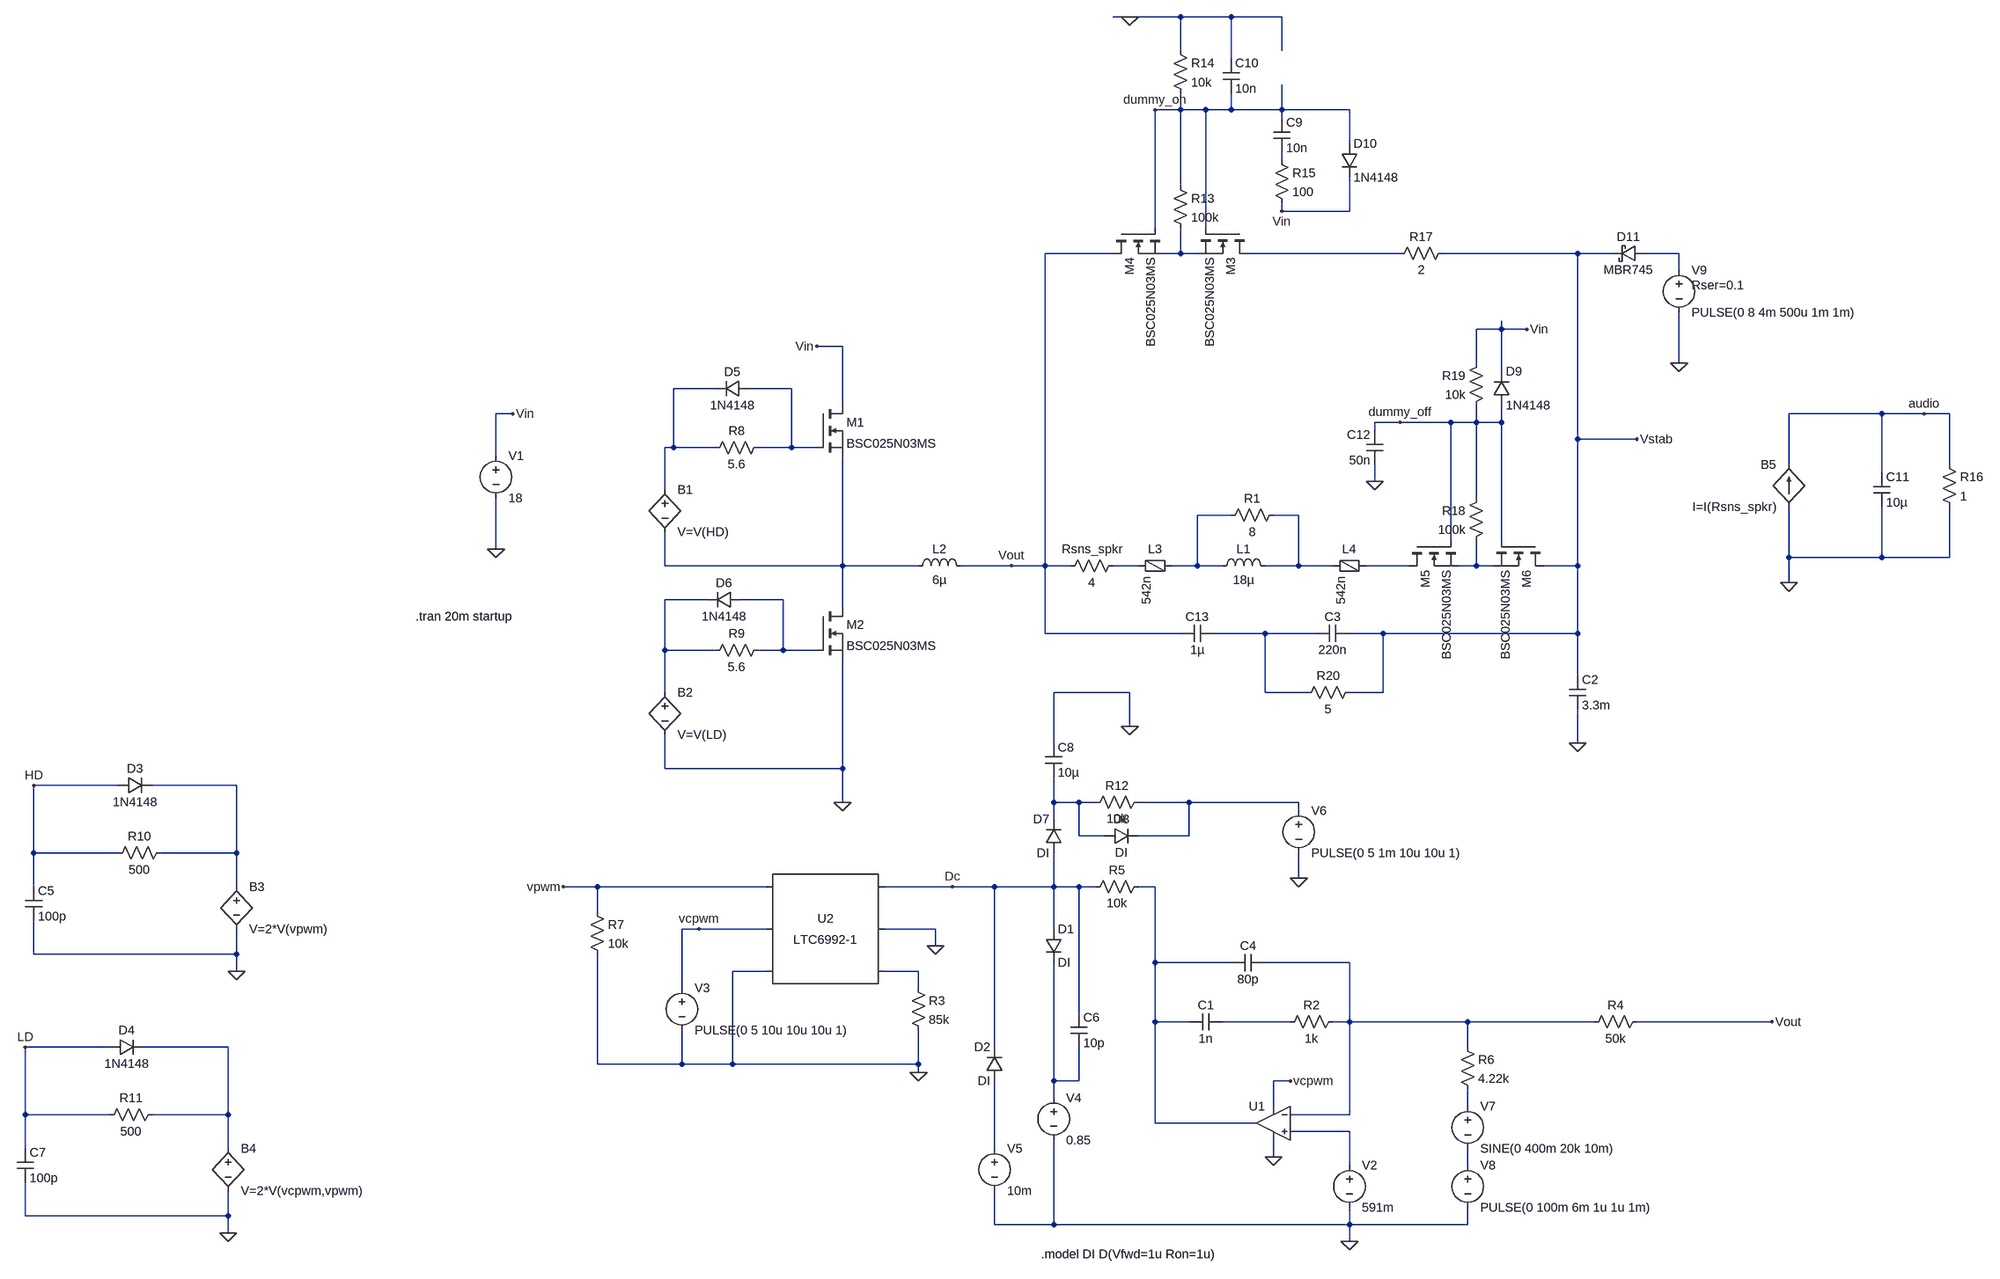
[diagram p0: schematic TPS40195_Power_Amp_Switching_Model.asc]
TPS40195_Power_Amp_Switching_Model.asc, the LTspice schematic file:
Version 4
SHEET 1 2888 1352
WIRE 848 -1008 816 -1008
WIRE 944 -1008 848 -1008
WIRE 1040 -1008 944 -1008
WIRE 1136 -1008 1040 -1008
WIRE 944 -944 944 -1008
WIRE 1136 -944 1136 -1008
WIRE 1040 -928 1040 -1008
WIRE 944 -832 944 -864
WIRE 944 -832 896 -832
WIRE 992 -832 944 -832
WIRE 1040 -832 1040 -864
WIRE 1040 -832 992 -832
WIRE 1136 -832 1136 -880
WIRE 1136 -832 1040 -832
WIRE 1264 -832 1136 -832
WIRE 1136 -816 1136 -832
WIRE 1264 -768 1264 -832
WIRE 1136 -736 1136 -752
WIRE 944 -688 944 -832
WIRE 1136 -640 1136 -656
WIRE 1264 -640 1264 -704
WIRE 1264 -640 1136 -640
WIRE 896 -608 896 -832
WIRE 992 -608 992 -832
WIRE 816 -560 688 -560
WIRE 944 -560 944 -608
WIRE 944 -560 912 -560
WIRE 976 -560 944 -560
WIRE 1360 -560 1072 -560
WIRE 1696 -560 1440 -560
WIRE 1760 -560 1696 -560
WIRE 1888 -560 1824 -560
WIRE 1888 -528 1888 -560
WIRE 1552 -416 1552 -432
WIRE 1552 -416 1504 -416
WIRE 1600 -416 1552 -416
WIRE 304 -384 256 -384
WIRE 1504 -352 1504 -416
WIRE 1888 -352 1888 -448
WIRE 1552 -336 1552 -416
WIRE 64 -304 -16 -304
WIRE 208 -304 128 -304
WIRE 304 -272 304 -384
WIRE -320 -256 -352 -256
WIRE 2272 -256 2096 -256
WIRE 2352 -256 2272 -256
WIRE 2400 -256 2352 -256
WIRE 1360 -240 1312 -240
WIRE 1456 -240 1360 -240
WIRE 1504 -240 1504 -272
WIRE 1504 -240 1456 -240
WIRE 1552 -240 1552 -272
WIRE 1552 -240 1504 -240
WIRE 1312 -224 1312 -240
WIRE 1696 -208 1696 -560
WIRE 1808 -208 1696 -208
WIRE -16 -192 -16 -304
WIRE -16 -192 -32 -192
WIRE 64 -192 -16 -192
WIRE 208 -192 208 -304
WIRE 208 -192 144 -192
WIRE 256 -192 208 -192
WIRE -352 -176 -352 -256
WIRE 2096 -160 2096 -256
WIRE 2400 -160 2400 -256
WIRE 2272 -144 2272 -256
WIRE 1312 -128 1312 -160
WIRE -32 -112 -32 -192
WIRE 1504 -96 1504 -240
WIRE 1040 -64 976 -64
WIRE 1168 -64 1120 -64
WIRE 1456 -16 1456 -240
WIRE 1552 -16 1552 -240
WIRE -352 0 -352 -96
WIRE 2096 16 2096 -80
WIRE 2272 16 2272 -80
WIRE 2272 16 2096 16
WIRE 2400 16 2400 -80
WIRE 2400 16 2272 16
WIRE -32 32 -32 -32
WIRE 304 32 304 -176
WIRE 304 32 -32 32
WIRE 448 32 304 32
WIRE 624 32 528 32
WIRE 688 32 688 -560
WIRE 688 32 624 32
WIRE 736 32 688 32
WIRE 864 32 816 32
WIRE 976 32 976 -64
WIRE 976 32 928 32
WIRE 1024 32 976 32
WIRE 1168 32 1168 -64
WIRE 1168 32 1104 32
WIRE 1232 32 1168 32
WIRE 1376 32 1296 32
WIRE 1504 32 1504 -16
WIRE 1504 32 1472 32
WIRE 1536 32 1504 32
WIRE 1696 32 1696 -208
WIRE 1696 32 1632 32
WIRE 2096 64 2096 16
WIRE 48 96 -32 96
WIRE 192 96 112 96
WIRE 304 112 304 32
WIRE 688 160 688 32
WIRE 944 160 688 160
WIRE 1104 160 1008 160
WIRE 1200 160 1104 160
WIRE 1328 160 1264 160
WIRE 1696 160 1696 32
WIRE 1696 160 1328 160
WIRE -32 192 -32 96
WIRE 64 192 -32 192
WIRE 192 192 192 96
WIRE 192 192 144 192
WIRE 256 192 192 192
WIRE 1696 240 1696 160
WIRE -32 272 -32 192
WIRE 848 272 704 272
WIRE 1104 272 1104 160
WIRE 1184 272 1104 272
WIRE 1328 272 1328 160
WIRE 1328 272 1264 272
WIRE 848 336 848 272
WIRE 704 368 704 272
WIRE 1696 368 1696 304
WIRE -32 416 -32 352
WIRE 304 416 304 208
WIRE 304 416 -32 416
WIRE -1152 448 -1312 448
WIRE -928 448 -1088 448
WIRE 304 480 304 416
WIRE 704 480 704 432
WIRE 752 480 704 480
WIRE 784 480 752 480
WIRE 960 480 864 480
WIRE 1168 480 960 480
WIRE 1168 496 1168 480
WIRE 704 512 704 480
WIRE 752 544 752 480
WIRE 800 544 752 544
WIRE 960 544 960 480
WIRE 960 544 864 544
WIRE -1312 576 -1312 448
WIRE -1152 576 -1312 576
WIRE -928 576 -928 448
WIRE -928 576 -1072 576
WIRE 1168 624 1168 576
WIRE -1312 640 -1312 576
WIRE -928 640 -928 576
WIRE -160 640 -224 640
WIRE 160 640 -160 640
WIRE 512 640 384 640
WIRE 592 640 512 640
WIRE 704 640 704 576
WIRE 704 640 592 640
WIRE 752 640 704 640
WIRE 784 640 752 640
WIRE 896 640 864 640
WIRE -160 688 -160 640
WIRE 32 720 0 720
WIRE 160 720 32 720
WIRE 480 720 384 720
WIRE 704 720 704 640
WIRE 480 752 480 720
WIRE -1312 768 -1312 704
WIRE -928 768 -928 720
WIRE -928 768 -1312 768
WIRE 896 784 896 640
WIRE 1040 784 896 784
WIRE 1264 784 1104 784
WIRE -928 800 -928 768
WIRE 160 800 96 800
WIRE 448 800 384 800
WIRE 0 832 0 720
WIRE 448 832 448 800
WIRE 752 880 752 640
WIRE 896 896 896 784
WIRE 960 896 896 896
WIRE 1152 896 1024 896
WIRE 1264 896 1264 784
WIRE 1264 896 1232 896
WIRE 1488 896 1264 896
WIRE 1728 896 1488 896
WIRE 2064 896 1808 896
WIRE -1168 944 -1328 944
WIRE -944 944 -1104 944
WIRE 592 944 592 640
WIRE 1488 944 1488 896
WIRE -160 976 -160 768
WIRE 0 976 0 912
WIRE 0 976 -160 976
WIRE 96 976 96 800
WIRE 96 976 0 976
WIRE 448 976 448 912
WIRE 448 976 96 976
WIRE 448 992 448 976
WIRE 704 1008 704 784
WIRE 752 1008 752 944
WIRE 752 1008 704 1008
WIRE 1152 1008 1120 1008
WIRE 704 1040 704 1008
WIRE 1120 1056 1120 1008
WIRE 1488 1056 1488 1024
WIRE -1328 1072 -1328 944
WIRE -1168 1072 -1328 1072
WIRE -944 1072 -944 944
WIRE -944 1072 -1088 1072
WIRE 1264 1072 1264 896
WIRE 1264 1072 1152 1072
WIRE 896 1088 896 896
WIRE 1088 1088 896 1088
WIRE 1264 1104 1152 1104
WIRE -1328 1136 -1328 1072
WIRE -944 1136 -944 1072
WIRE 592 1136 592 1008
WIRE 1120 1152 1120 1120
WIRE 1264 1168 1264 1104
WIRE 1488 1168 1488 1136
WIRE -1328 1264 -1328 1200
WIRE -944 1264 -944 1216
WIRE -944 1264 -1328 1264
WIRE 592 1280 592 1216
WIRE 704 1280 704 1120
WIRE 704 1280 592 1280
WIRE 1264 1280 1264 1248
WIRE 1264 1280 704 1280
WIRE 1488 1280 1488 1248
WIRE 1488 1280 1264 1280
WIRE -944 1296 -944 1264
WIRE 1264 1312 1264 1280
FLAG 1696 368 0
FLAG -352 0 0
FLAG 624 32 Vout
FLAG -320 -256 Vin
FLAG 512 640 Dc
FLAG 1120 1152 0
FLAG 1264 1312 0
FLAG 2064 896 Vout
FLAG 1808 -208 Vstab
FLAG 304 480 0
FLAG 256 -384 Vin
FLAG 480 752 0
FLAG 448 992 0
FLAG -224 640 vpwm
FLAG -928 800 0
FLAG -1312 448 HD
FLAG -944 1296 0
FLAG -1328 944 LD
FLAG 32 720 vcpwm
FLAG 848 336 0
FLAG 1168 624 0
FLAG 1136 -640 Vin
FLAG 848 -1008 0
FLAG 2096 64 0
FLAG 2352 -256 audio
FLAG 1152 1008 vcpwm
FLAG 1600 -416 Vin
FLAG 1312 -128 0
FLAG 896 -832 dummy_on
FLAG 1360 -240 dummy_off
FLAG 1888 -352 0
DATAFLAG 624 640 ""
DATAFLAG 928 784 ""
SYMBOL voltage -352 -192 R0
WINDOW 123 0 0 Left 0
WINDOW 39 0 0 Left 0
SYMATTR InstName V1
SYMATTR Value 18
SYMBOL ind 1008 48 R270
WINDOW 0 32 56 VTop 2
WINDOW 3 5 56 VBottom 2
SYMATTR InstName L1
SYMATTR Value 18µ
SYMATTR SpiceLine Rser=1u
SYMBOL cap 1680 240 R0
SYMATTR InstName C2
SYMATTR Value 3.3m
SYMATTR SpiceLine Rser=20m
SYMBOL cap 1264 144 R90
WINDOW 0 0 32 VBottom 2
WINDOW 3 32 32 VTop 2
SYMATTR InstName C3
SYMATTR Value 220n
SYMBOL res 1024 -48 R270
WINDOW 0 32 56 VTop 2
WINDOW 3 0 56 VBottom 2
SYMATTR InstName R1
SYMATTR Value 8
SYMBOL Opamps\\UniversalOpamp2 1120 1088 M0
SYMATTR InstName U1
SYMATTR Value2 Avol=1k GBW=7Meg Slew=10Meg
SYMATTR SpiceLine ilimit=25m rail=0 Vos=0 phimargin=68
SYMBOL voltage 1264 1152 R0
WINDOW 123 0 0 Left 0
WINDOW 39 0 0 Left 0
SYMATTR InstName V2
SYMATTR Value 591m
SYMBOL cap 1024 880 R90
WINDOW 0 0 32 VBottom 2
WINDOW 3 32 32 VTop 2
SYMATTR InstName C1
SYMATTR Value 1n
SYMBOL res 1248 880 R90
WINDOW 0 0 56 VBottom 2
WINDOW 3 32 56 VTop 2
SYMATTR InstName R2
SYMATTR Value 1k
SYMBOL cap 1104 768 R90
WINDOW 0 0 32 VBottom 2
WINDOW 3 32 32 VTop 2
SYMATTR InstName C4
SYMATTR Value 80p
SYMBOL res 1824 880 R90
WINDOW 0 0 56 VBottom 2
WINDOW 3 32 56 VTop 2
SYMATTR InstName R4
SYMATTR Value 50k
SYMBOL res 880 624 R90
WINDOW 0 0 56 VBottom 2
WINDOW 3 32 56 VTop 2
SYMATTR InstName R5
SYMATTR Value 10k
SYMBOL res 1472 928 R0
SYMATTR InstName R6
SYMATTR Value 4.22k
SYMBOL diode 688 720 R0
SYMATTR InstName D1
SYMATTR Value DI
SYMBOL voltage 704 1024 R0
WINDOW 123 0 0 Left 0
WINDOW 39 0 0 Left 0
SYMATTR InstName V4
SYMATTR Value 0.85
SYMBOL diode 608 1008 R180
WINDOW 0 24 64 Left 2
WINDOW 3 24 0 Left 2
SYMATTR InstName D2
SYMATTR Value DI
SYMBOL voltage 592 1120 R0
WINDOW 123 0 0 Left 0
WINDOW 39 0 0 Left 0
SYMATTR InstName V5
SYMATTR Value 10m
SYMBOL voltage 1488 1040 R0
WINDOW 123 0 0 Left 0
WINDOW 39 0 0 Left 0
SYMATTR InstName V7
SYMATTR Value SINE(0 400m 20k 10m)
SYMBOL cap 736 880 R0
SYMATTR InstName C6
SYMATTR Value 10p
SYMBOL nmos 256 -272 R0
SYMATTR InstName M1
SYMATTR Value BSC025N03MS
SYMBOL nmos 256 112 R0
SYMATTR InstName M2
SYMATTR Value BSC025N03MS
SYMBOL ind 432 48 R270
WINDOW 0 32 56 VTop 2
WINDOW 3 5 56 VBottom 2
SYMATTR InstName L2
SYMATTR Value 6µ
SYMATTR SpiceLine Rser=20m
SYMBOL res 160 -208 R90
WINDOW 0 0 56 VBottom 2
WINDOW 3 32 56 VTop 2
SYMATTR InstName R8
SYMATTR Value 5.6
SYMBOL bv -32 -128 R0
SYMATTR InstName B1
SYMATTR Value V=V(HD)
SYMBOL res 160 176 R90
WINDOW 0 0 56 VBottom 2
WINDOW 3 32 56 VTop 2
SYMATTR InstName R9
SYMATTR Value 5.6
SYMBOL bv -32 256 R0
SYMATTR InstName B2
SYMATTR Value V=V(LD)
SYMBOL SpecialFunctions\\LTC6992-1 272 720 M0
SYMATTR InstName U2
SYMBOL voltage 0 816 R0
WINDOW 123 0 0 Left 0
WINDOW 39 0 0 Left 0
SYMATTR InstName V3
SYMATTR Value PULSE(0 5 10u 10u 10u 1)
SYMBOL res 432 816 R0
SYMATTR InstName R3
SYMATTR Value 85k
SYMBOL res -176 672 R0
SYMATTR InstName R7
SYMATTR Value 10k
SYMBOL bv -928 624 R0
SYMATTR InstName B3
SYMATTR Value V=2*V(vpwm)
SYMBOL res -1056 560 R90
WINDOW 0 0 56 VBottom 2
WINDOW 3 32 56 VTop 2
SYMATTR InstName R10
SYMATTR Value 500
SYMBOL diode -1152 464 R270
WINDOW 0 32 32 VTop 2
WINDOW 3 0 32 VBottom 2
SYMATTR InstName D3
SYMATTR Value 1N4148
SYMBOL cap -1328 640 R0
SYMATTR InstName C5
SYMATTR Value 100p
SYMBOL bv -944 1120 R0
SYMATTR InstName B4
SYMATTR Value V=2*V(vcpwm,vpwm)
SYMBOL res -1072 1056 R90
WINDOW 0 0 56 VBottom 2
WINDOW 3 32 56 VTop 2
SYMATTR InstName R11
SYMATTR Value 500
SYMBOL diode -1168 960 R270
WINDOW 0 32 32 VTop 2
WINDOW 3 0 32 VBottom 2
SYMATTR InstName D4
SYMATTR Value 1N4148
SYMBOL cap -1344 1136 R0
SYMATTR InstName C7
SYMATTR Value 100p
SYMBOL diode 128 -320 R90
WINDOW 0 0 32 VBottom 2
WINDOW 3 32 32 VTop 2
SYMATTR InstName D5
SYMATTR Value 1N4148
SYMBOL diode 112 80 R90
WINDOW 0 0 32 VBottom 2
WINDOW 3 32 32 VTop 2
SYMATTR InstName D6
SYMATTR Value 1N4148
SYMBOL cap 688 368 R0
SYMATTR InstName C8
SYMATTR Value 10µ
SYMBOL diode 720 576 R180
WINDOW 0 24 64 Left 2
WINDOW 3 24 0 Left 2
SYMATTR InstName D7
SYMATTR Value DI
SYMBOL res 880 464 R90
WINDOW 0 0 56 VBottom 2
WINDOW 3 32 56 VTop 2
SYMATTR InstName R12
SYMATTR Value 10k
SYMBOL diode 800 560 R270
WINDOW 0 32 32 VTop 2
WINDOW 3 0 32 VBottom 2
SYMATTR InstName D8
SYMATTR Value DI
SYMBOL voltage 1168 480 R0
WINDOW 123 0 0 Left 0
WINDOW 39 0 0 Left 0
SYMATTR InstName V6
SYMATTR Value PULSE(0 5 1m 10u 10u 1)
SYMBOL nmos 1072 -608 R90
SYMATTR InstName M3
SYMATTR Value BSC025N03MS
SYMBOL nmos 816 -608 M90
SYMATTR InstName M4
SYMATTR Value BSC025N03MS
SYMBOL res 928 -704 R0
SYMATTR InstName R13
SYMATTR Value 100k
SYMBOL cap 1120 -816 R0
SYMATTR InstName C9
SYMATTR Value 10n
SYMBOL res 928 -960 R0
SYMATTR InstName R14
SYMATTR Value 10k
SYMBOL cap 1024 -928 R0
SYMATTR InstName C10
SYMATTR Value 10n
SYMBOL res 1120 -752 R0
SYMATTR InstName R15
SYMATTR Value 100
SYMBOL res 720 48 R270
WINDOW 0 32 56 VTop 2
WINDOW 3 0 56 VBottom 2
SYMATTR InstName Rsns_spkr
SYMATTR Value 4
SYMBOL bi 2096 -80 R180
WINDOW 0 24 80 Left 2
WINDOW 3 24 0 Left 2
SYMATTR InstName B5
SYMATTR Value I=I(Rsns_spkr)
SYMBOL cap 2256 -144 R0
SYMATTR InstName C11
SYMATTR Value 10µ
SYMBOL res 2384 -176 R0
SYMATTR InstName R16
SYMATTR Value 1
SYMBOL FerriteBead 896 32 R90
WINDOW 0 -16 0 VBottom 2
SYMATTR InstName L3
SYMATTR Value 542n
SYMATTR SpiceLine Ipk=4 Rser=0.0103 Rpar=277.6 Cpar=240.8p mfg="Würth Elektronik" pn="74279224171 WE-MPSB 2220"
SYMBOL FerriteBead 1264 32 R90
WINDOW 0 -16 0 VBottom 2
SYMATTR InstName L4
SYMATTR Value 542n
SYMATTR SpiceLine Ipk=4 Rser=0.0103 Rpar=277.6 Cpar=240.8p mfg="Würth Elektronik" pn="74279224171 WE-MPSB 2220"
SYMBOL res 1456 -576 R90
WINDOW 0 0 56 VBottom 2
WINDOW 3 32 56 VTop 2
SYMATTR InstName R17
SYMATTR Value 2
SYMBOL nmos 1376 -16 M90
SYMATTR InstName M5
SYMATTR Value BSC025N03MS
SYMBOL nmos 1632 -16 R90
SYMATTR InstName M6
SYMATTR Value BSC025N03MS
SYMBOL res 1520 -112 M0
SYMATTR InstName R18
SYMATTR Value 100k
SYMBOL cap 1328 -224 M0
SYMATTR InstName C12
SYMATTR Value 50n
SYMBOL res 1520 -368 M0
SYMATTR InstName R19
SYMATTR Value 10k
SYMBOL diode 1536 -272 M180
WINDOW 0 24 64 Left 2
WINDOW 3 24 0 Left 2
SYMATTR InstName D9
SYMATTR Value 1N4148
SYMBOL diode 1248 -768 R0
SYMATTR InstName D10
SYMATTR Value 1N4148
SYMBOL cap 1008 144 R90
WINDOW 0 0 32 VBottom 2
WINDOW 3 32 32 VTop 2
SYMATTR InstName C13
SYMATTR Value 1µ
SYMBOL res 1280 256 R90
WINDOW 0 0 56 VBottom 2
WINDOW 3 32 56 VTop 2
SYMATTR InstName R20
SYMATTR Value 5
SYMBOL voltage 1488 1152 R0
WINDOW 123 0 0 Left 0
WINDOW 39 0 0 Left 0
SYMATTR InstName V8
SYMATTR Value PULSE(0 100m 6m 1u 1u 1m)
SYMBOL voltage 1888 -544 R0
WINDOW 123 0 0 Left 0
WINDOW 39 24 44 Left 2
SYMATTR SpiceLine Rser=0.1
SYMATTR InstName V9
SYMATTR Value PULSE(0 8 4m 500u 1m 1m)
SYMBOL schottky 1824 -576 R90
WINDOW 0 0 32 VBottom 2
WINDOW 3 32 32 VTop 2
SYMATTR InstName D11
SYMATTR Value MBR745
SYMATTR Description Diode
SYMATTR Type diode
TEXT 680 1336 Left 2 !.model DI D(Vfwd=1u Ron=1u)
TEXT -504 128 Left 2 !.tran 20m startup

The netlist it stands for:
* TPS40195_Power_Amp_Switching_Model.asc
V1 Vin 0 18
L1 N007 N008 18µ Rser=1u
C2 Vstab 0 3.3m Rser=20m
C3 Vstab N015 220n
R1 N007 N008 8
XU1 N026 N020 vcpwm 0 N019 level.2 Avol=1k GBW=7Meg Slew=10Meg ilimit=25m rail=0 Vos=0 phimargin=68 en=0 enk=0 in=0 ink=0 Rin=500Meg  ; pins IN+ IN- V+ V- OUT
V2 N026 0 591m
C1 N022 N019 1n
R2 N020 N022 1k
C4 N020 N019 80p
R4 Vout N020 50k
R5 N019 Dc 10k
R6 N020 N025 4.22k
D1 Dc N024 DI
V4 N024 0 0.85
D2 N027 Dc DI
V5 N027 0 10m
V7 N025 N028 SINE(0 400m 20k 10m)
C6 Dc N024 10p
M1 Vin N006 N009 N009 BSC025N03MS
M2 N009 N014 0 0 BSC025N03MS
L2 N009 Vout 6µ Rser=20m
R8 N006 N005 5.6
B1 N005 N009 V=V(HD)
R9 N014 N013 5.6
B2 N013 0 V=V(LD)
XU2 Dc 0 N021 0 vcpwm vpwm LTC6992-1
V3 vcpwm 0 PULSE(0 5 10u 10u 10u 1)
R3 N021 0 85k
R7 vpwm 0 10k
B3 N016 0 V=2*V(vpwm)
R10 N016 HD 500
D3 HD N016 1N4148
C5 HD 0 100p
B4 N023 0 V=2*V(vcpwm,vpwm)
R11 N023 LD 500
D4 LD N023 1N4148
C7 LD 0 100p
D5 N006 N005 1N4148
D6 N014 N013 1N4148
C8 0 N017 10µ
D7 Dc N017 DI
R12 N018 N017 10k
D8 N017 N018 DI
V6 N018 0 PULSE(0 5 1m 10u 10u 1)
M3 N003 dummy_on N002 N002 BSC025N03MS
M4 Vout dummy_on N002 N002 BSC025N03MS
R13 dummy_on N002 100k
C9 dummy_on N001 10n
R14 0 dummy_on 10k
C10 0 dummy_on 10n
R15 N001 Vin 100
Rsns_spkr Vout N010 4
B5 0 audio I=I(Rsns_spkr)
C11 audio 0 10µ
R16 audio 0 1
L3 N007 N010 542n Ipk=4 Rser=0.0103 Rpar=277.6 Cpar=240.8p mfg="Würth Elektronik" pn="74279224171 WE-MPSB 2220"
L4 N011 N008 542n Ipk=4 Rser=0.0103 Rpar=277.6 Cpar=240.8p mfg="Würth Elektronik" pn="74279224171 WE-MPSB 2220"
R17 Vstab N003 2
M5 N011 dummy_off N012 N012 BSC025N03MS
M6 Vstab dummy_off N012 N012 BSC025N03MS
R18 dummy_off N012 100k
C12 dummy_off 0 50n
R19 Vin dummy_off 10k
D9 dummy_off Vin 1N4148
D10 dummy_on Vin 1N4148
C13 N015 Vout 1µ
R20 Vstab N015 5
V8 N028 0 PULSE(0 100m 6m 1u 1u 1m)
V9 N004 0 PULSE(0 8 4m 500u 1m 1m) Rser=0.1
D11 N004 Vstab MBR745
.model D D
.lib standard.dio
.model NMOS NMOS
.model PMOS PMOS
.lib standard.mos
.model DI D(Vfwd=1u Ron=1u)
.tran 20m startup
.lib UniversalOpamps2.sub
.lib LTC6992-1.sub
.backanno
.end